# EAGLE design stx_v2 (EAGLE 7.7.0)
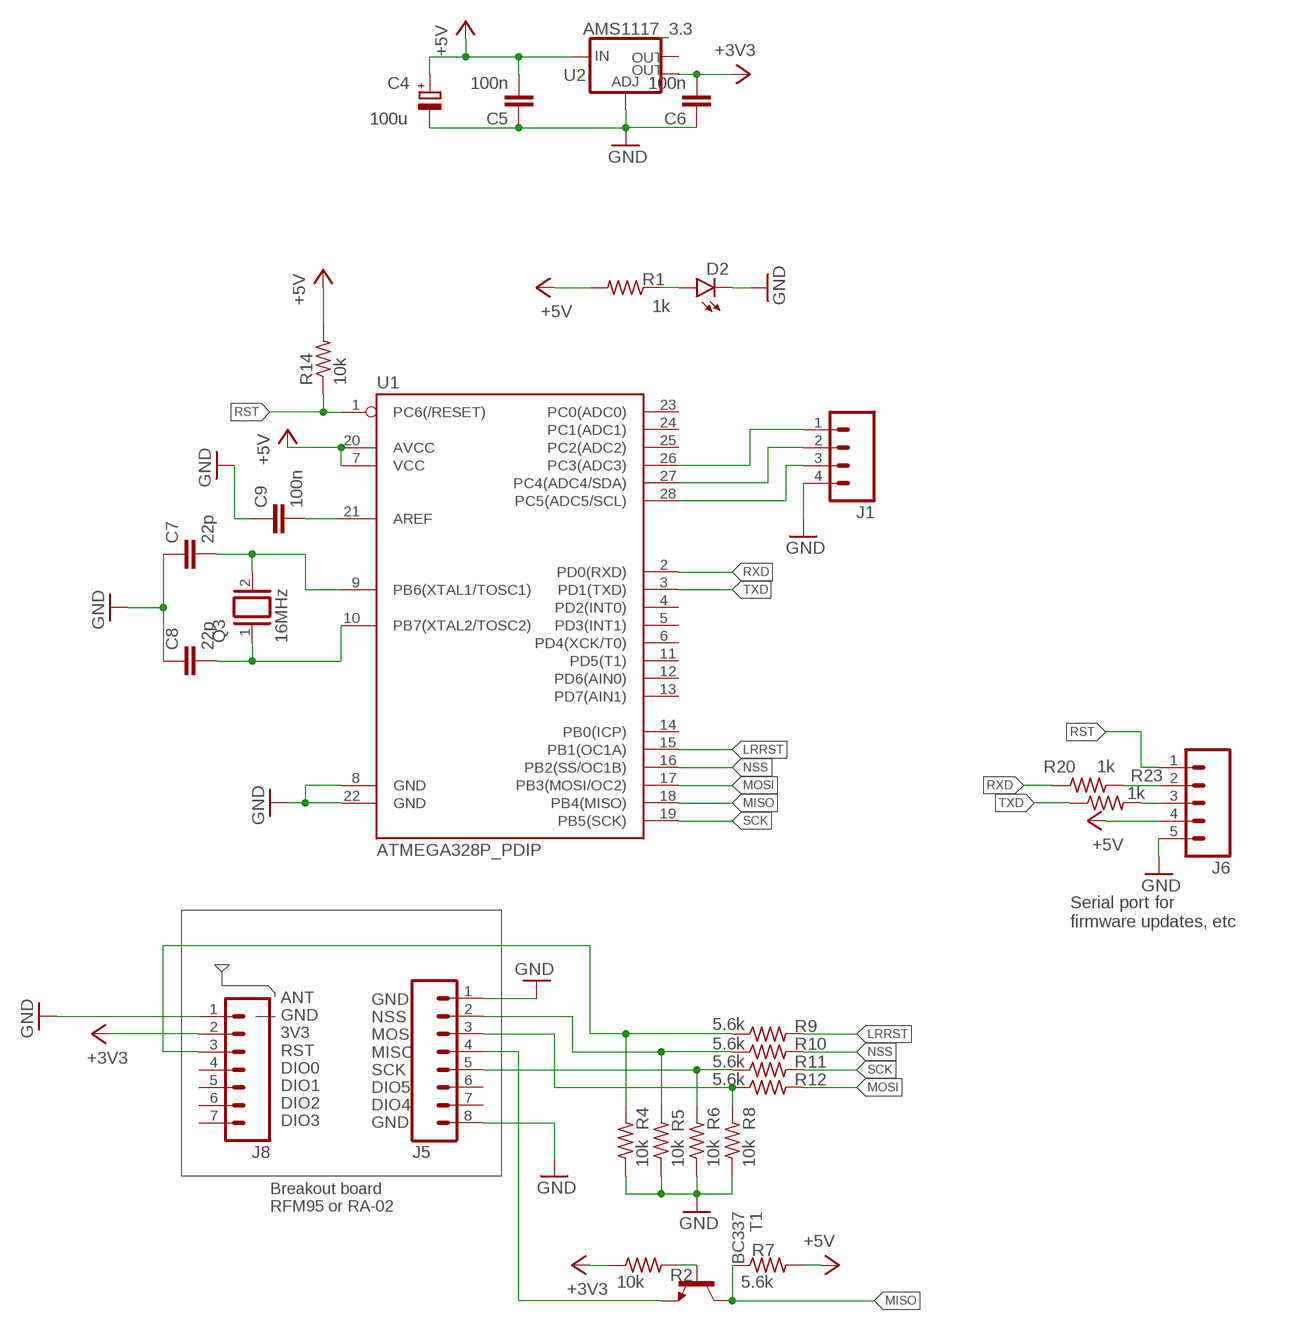
[diagram p0: schematic, sheet 1]

## Parts
C4  100u  CPOL-EUE2,5-6E  [E2,5-6E]
C5  100n  C-EU050-024X044  [C050-024X044]
C6  100n  C-EU050-024X044  [C050-024X044]
C7  22p  C-EU050-024X044  [C050-024X044]
C8  22p  C-EU050-024X044  [C050-024X044]
C9  100n  C-EU050-024X044  [C050-024X044]
D2  LED3MM  [LED3MM]
J1  M04PTH  [1X04]
J5  M08  [1X08_ROUND]
J6  M05PTH  [1X05]
J8  M07  [1X07]
Q3  16MHz  XTAL/S  [QS]
R1  1k  R-US_0204/2V  [0204V]
R2  10k  R-US_0204/7  [0204/7]
R4  10k  R-US_0204/2V  [0204V]
R5  10k  R-US_0204/2V  [0204V]
R6  10k  R-US_0204/2V  [0204V]
R7  5.6k  R-US_0204/2V  [0204V]
R8  10k  R-US_0204/2V  [0204V]
R9  5.6k  R-US_0204/2V  [0204V]
R10  5.6k  R-US_0204/2V  [0204V]
R11  5.6k  R-US_0204/2V  [0204V]
R12  5.6k  R-US_0204/2V  [0204V]
R14  10k  R-US_0204/7  [0204/7]
R20  1k  R-US_0204/7  [0204/7]
R23  1k  R-US_0204/7  [0204/7]
T1  BC337  [TO92]
U1  ATMEGA328P_PDIP  [DIL28-3]
U2  AMS1117_3.3  V_REG_LM1117SOT223  [SOT223]

## Nets
+3V3: C6.2 J8.2 R2.1 U2.4(OUT)
+5V: C4.+ C5.2 J6.4 R1.2 R7.2 R14.2 U1.7(VCC) U1.20(AVCC) U2.3(IN)
GND: C4.- C5.1 C6.1 C7.1 C8.1 C9.1 D2.K(C) J1.4 J5.1 J5.8 J6.5 J8.1 R4.1 R5.1 R6.1 R8.1 U1.8(GND) U1.22(GND) U2.1(ADJ)
LRRST: R9.2 U1.15(PB1(OC1A))
MISO: R7.1 T1.3(C) U1.18(PB4(MISO))
MOSI: R12.2 U1.17(PB3(MOSI/OC2))
N$1: D2.A R1.1
N$2: J1.3 U1.28(PC5(ADC5/SCL))
N$3: J5.4 T1.1(E)
N$4: J1.2 U1.27(PC4(ADC4/SDA))
N$5: J1.1 U1.26(PC3(ADC3))
N$6: J8.3 R4.2 R9.1
N$7: J5.2 R5.2 R10.1
N$8: J5.5 R6.2 R11.1
N$9: J5.3 R8.2 R12.1
N$10: C9.2 U1.21(AREF)
N$14: J6.3 R23.2
N$17: C7.2 Q3.2 U1.9(PB6(XTAL1/TOSC1))
N$19: C8.2 Q3.1 U1.10(PB7(XTAL2/TOSC2))
N$21: J6.2 R20.2
N$33: R2.2 T1.2(B)
NSS: R10.2 U1.16(PB2(SS/OC1B))
RST: J6.1 R14.1 U1.1(PC6(/RESET))
RXD: R20.1 U1.2(PD0(RXD))
SCK: R11.2 U1.19(PB5(SCK))
TXD: R23.1 U1.3(PD1(TXD))
Unconnected: J5.6 J5.7 J8.4 J8.5 J8.6 J8.7 U1.4(PD2(INT0)) U1.5(PD3(INT1)) U1.6(PD4(XCK/T0)) U1.11(PD5(T1)) U1.12(PD6(AIN0)) U1.13(PD7(AIN1)) U1.14(PB0(ICP)) U1.23(PC0(ADC0)) U1.24(PC1(ADC1)) U1.25(PC2(ADC2)) U2.2(OUT)

## Notes on the sheet
- Serial port for
  firmware updates, etc
- ANT
  GND
  3V3
  RST
  DIO0
  DIO1
  DIO2
  DIO3
- GND
  NSS
  MOSI
  MISO
  SCK
  DIO5
  DIO4
  GND
- Breakout board
  RFM95 or RA-02

## Library data of the parts
C4 = rcl:CPOL-EU: POLARIZED CAPACITOR, European symbol
C5-C9 = rcl:C-EU: CAPACITOR, European symbol
D2 = SparkFun-LED:LED: LEDs Standard schematic elements and footprints for 5mm, 3mm, 1206, and 0603 sized LEDs. 5mm - Spark Fun Electronics SKU : COM-00529 (and others); PROD_ID: DIO-08794
J1 = SparkFun-Connectors:M04: Header 4 Standard 4-pin 0.1" header. Use with straight break away headers (SKU : PRT-00116), right angle break away headers (PRT-00553), swiss pins (PRT-00743), machine pins (PRT-00117), and female headers (PRT-00115). Molex polarized connector foot print use with SKU : PRT-08231 with associated crimp pins and housings. 1MM SMD Version SKU: PRT-10208; PROD_ID: CONN-09696
J5 = SparkFun-Connectors:M08: Header 8 Standard 8-pin 0.1" header. Use with straight break away headers (SKU : PRT-00116), right angle break away headers (PRT-00553), swiss pins (PRT-00743), machine pins (PRT-00117), and female headers (PRT-00115).; PROD_ID: CONN-08437
J6 = SparkFun-Connectors:M05: Header 5 Standard 5-pin 0.1" header. Use with straight break away headers (SKU : PRT-00116), right angle break away headers (PRT-00553), swiss pins (PRT-00743), machine pins (PRT-00117), and female headers (PRT-00115). Molex polarized connector foot print use with SKU : PRT-08230 with associated crimp pins and housings.
J8 = SparkFun-Connectors:M07: Header 7 Standard 7-pin 0.1" header. Use with straight break away headers (SKU : PRT-00116), right angle break away headers (PRT-00553), swiss pins (PRT-00743), machine pins (PRT-00117), and female headers (PRT-00115). NOTES ON THE VARIANTS LOCK and LOCK_LONGPADS... This footprint was designed to help hold the alignment of a through-hole component (i.e. 7-pin header) while soldering it into place. You may notice that each hole has been shifted either up or down by 0.005 of an inch from it's more standard position (which is usually a perfectly straight line). This slight alteration caused the pins (the squares in the middle) to touch the edges of the holes. Because they are alternating, it causes a "brace" to hold the header in place. 0.005 has proven to be the perfect amount of "off-center" position when using our standard breakaway headers. Although looks a little odd when you look at the bare footprint, once you have a header in there, the alteration is very hard to notice. Also, if you push a header all the way into place, it is covered up entirely on the bottom side. This idea of altering the position of holes to aid alignment will be further integrated into the Sparkfun Library for other footprints. It can help hold any component with 3 or more connection pins.
Q3 = special:XTAL/S: CRYSTAL
R1 R2 R4-R12 R14 R20 R23 = rcl:R-US_: RESISTOR, American symbol
T1 = transistor:BC337: NPN TRANSISTOR
U1 = SparkFun-DigitalIC:ATMEGA328P_PDIP: uC used in the Arduino 32kb flash, 1k EEPROM, 2k SRAM This is the through-hole version of this chip.
U2 = SparkFun-PowerIC:V_REG_LM1117: Voltage Regulator LM1117 Standard adjustable voltage regulator but in SMD form. Spark Fun Electronics SKU : COM-00595; PROD_ID: VREG-08170

## Net classes
1 rf: clearance 0.5 mm

## Board
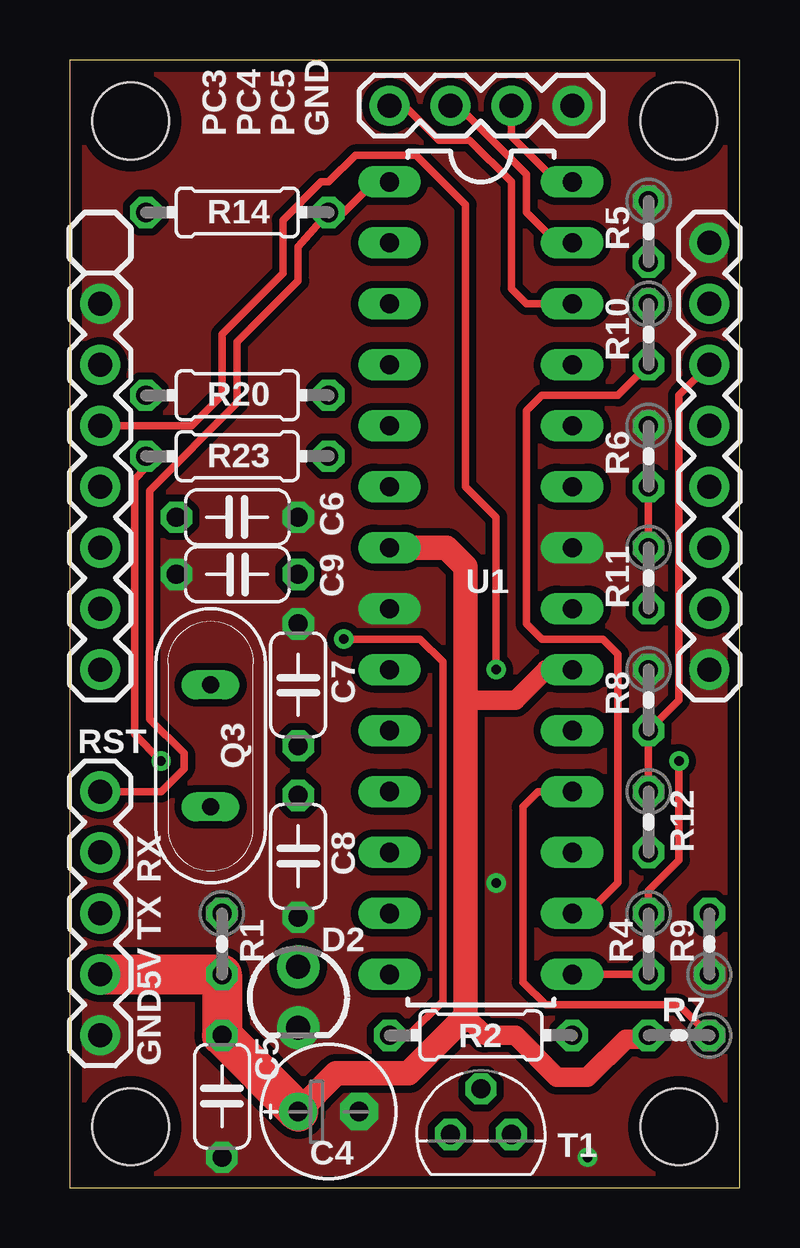
[diagram p1: board, top side]
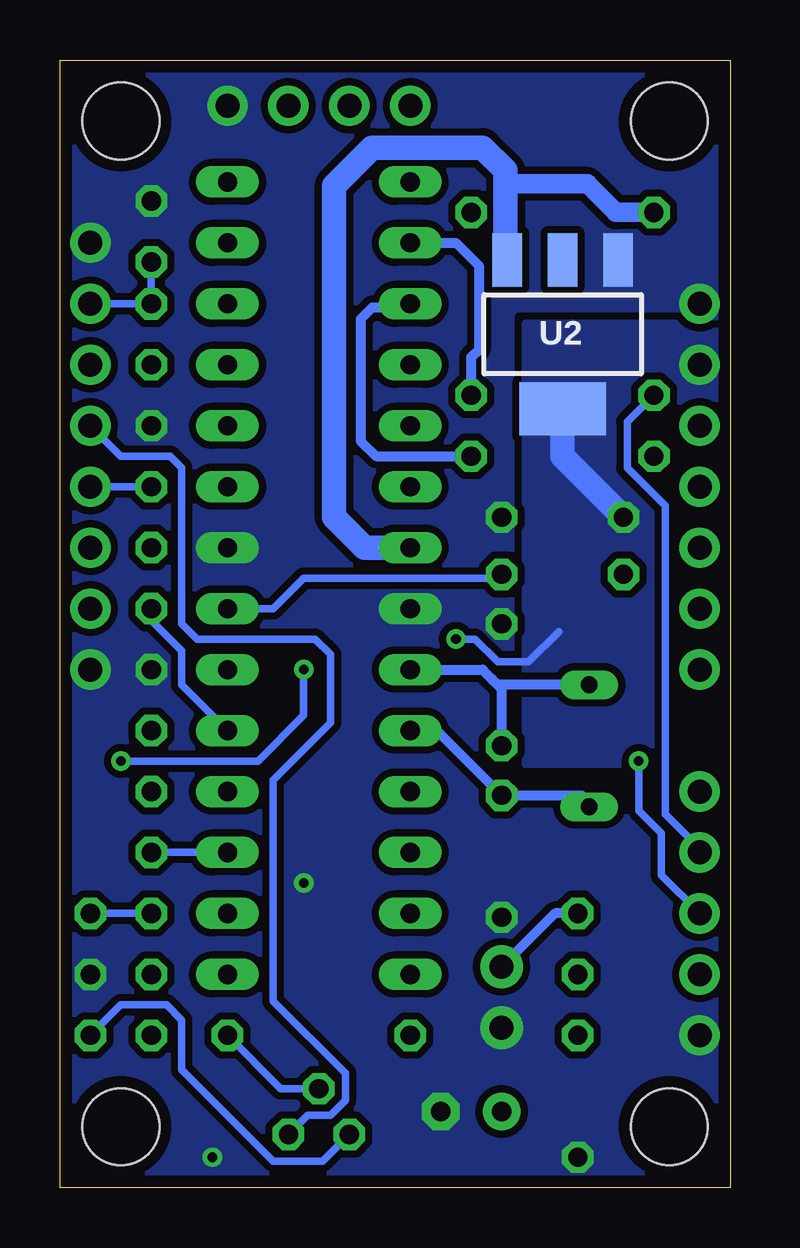
[diagram p2: board, bottom side, seen from below]

Size 27.94 x 46.99 mm. Coordinates in mm from the lower left corner, seen from the top.
Outline: 27.94,0 27.94,46.99 0,46.99 0,0 27.94,0
Copper layers (1*16): Top 0.035mm / dielectric 1.5mm / Bottom 0.035mm
Design rules "default *": minimum track width 10mil, minimum drill 0.4mm, track to track 0.3mm, track to pad 0.3mm, pad to pad 0.3mm, via to via 0.3mm, smd to smd 8mil, copper to edge 0.5mm, drill to drill 8mil, minimum pad ring 10mil, minimum via ring 8mil, stop-mask expansion 4mil, vias tented up to drill 0.8mm, thermal gap 10mil
Holes 3.2 mm at 2.54,44.45 25.4,44.45 2.54,2.54 25.4,2.54

### Footprints (pad centres in the part's own frame; a part is rotated, then mirrored left to right if it is on the bottom)
E2,5-6E = drill 0.8 pad 1.575: + -1.27,0 | drill 0.8 pad 1.575 octagon: - 1.27,0
C050-024X044 = drill 0.8 octagon: 1 -2.54,0; 2 2.54,0
LED3MM = drill 1 pad 1.778: A -1.27,0; K 1.27,0
1X04 = drill 1 pad 1.676: 1 0,0; 2 2.54,0; 3 5.08,0; 4 7.62,0
1X08_ROUND = drill 1 pad 1.676: 1 0,0; 2 2.54,0; 3 5.08,0; 4 7.62,0; 5 10.16,0; 6 12.7,0; 7 15.24,0; 8 17.78,0
1X05 = drill 1 pad 1.676: 1 0,0; 2 2.54,0; 3 5.08,0; 4 7.62,0; 5 10.16,0
1X07 = drill 1 pad 1.676: 1 0,0; 2 2.54,0; 3 5.08,0; 4 7.62,0; 5 10.16,0; 6 12.7,0; 7 15.24,0
QS = drill 0.7 pad 1.016 long: 1 -2.54,0; 2 2.54,0
0204V = drill 0.8 octagon: 1 -1.27,0; 2 1.27,0
0204/7 = drill 0.8 octagon: 1 -3.81,0; 2 3.81,0
TO92 = drill 0.8 octagon: 1 1.27,0; 2 0,1.905; 3 -1.27,0
DIL28-3 = drill 0.8 long: 1 -16.51,-3.81; 2 -13.97,-3.81; 3 -11.43,-3.81; 4 -8.89,-3.81; 5 -6.35,-3.81; 6 -3.81,-3.81; 7 -1.27,-3.81; 8 1.27,-3.81; 9 3.81,-3.81; 10 6.35,-3.81; 11 8.89,-3.81; 12 11.43,-3.81; 13 13.97,-3.81; 14 16.51,-3.81; 15 16.51,3.81; 16 13.97,3.81; 17 11.43,3.81; 18 8.89,3.81; 19 6.35,3.81; 20 3.81,3.81; 21 1.27,3.81; 22 -1.27,3.81; 23 -3.81,3.81; 24 -6.35,3.81; 25 -8.89,3.81; 26 -11.43,3.81; 27 -13.97,3.81; 28 -16.51,3.81
SOT223 = smd 1.219 x 2.235: 1 -2.311,-3.099; 2 0,-3.099; 3 2.311,-3.099 | smd 3.6 x 2.2: 4 0,3.099

### Placement (x,y rotation side)
C4  10.79,3.17 0 top
C5  6.35,3.81 90 top
C6  6.99,27.94 180 top
C7  9.53,20.95 270 top
C8  9.53,13.81 90 top
C9  6.99,25.56 0 top
D2  9.53,7.94 270 top
J1  13.34,45.09 0 top
J5  26.67,39.37 270 top
J6  1.27,16.51 270 top
J8  1.27,36.83 270 top
Q3  5.87,18.41 90 top
R1  6.35,10.16 270 top
R2  17.14,6.35 0 top
R4  26.67,10.16 90 top
R5  24.13,39.85 270 top
R6  24.13,30.48 270 top
R7  25.4,6.35 180 top
R8  24.13,20.32 270 top
R9  24.13,10.16 270 top
R10  24.13,35.56 270 top
R11  24.13,25.4 270 top
R12  24.13,15.24 270 top
R14  6.99,40.64 180 top
R20  6.99,33.02 180 top
R23  6.99,30.48 180 top
T1  17.14,2.22 0 top
U1  17.14,25.4 270 top
U2  6.99,35.56 180 bottom

### Tracks (layer width: path | path; a pad name or v marks a point on that pad's centre or on a via)
+3V3  (via drill 0.4)
  Top 0.305: v11.43,22.86 14.61,22.86 15.56,21.91 15.56,7.78 14.13,6.35 R2.1
  Bottom 0.305: v11.43,22.86 10.64,22.86 9.68,21.91 8.41,21.91 7.14,23.18
  Bottom 1.016: C6.2 6.99,30.48 U2.4
  pour Bottom (isolate 0.305, no thermals): 0,36.04 8.57,36.04 8.57,17.62 0,17.62
+5V
  Top 0.813: U1.20 19.84,21.59 18.57,20.32 16.51,20.32 | R7.2 23.97,6.19 23.18,6.19 21.59,4.6 20.32,4.6 18.57,6.35 17.3,6.35 16.51,7.14
  Top 1.016: C4.+ 11.11,4.76 14.13,4.76 16.51,7.14 16.51,20.32 16.51,25.88 15.72,26.67 U1.7
  Top 1.676: J6.4 R1.2 C5.2 C4.+
  Bottom 0.813: U2.3 9.21,38.75 | R14.2 4.76,40.64 5.95,41.83 9.29,41.83 9.37,41.91
  Bottom 1.016: U1.7 15.24,26.67 16.51,27.94 16.51,41.75 14.92,43.34 10.32,43.34 9.37,42.39 9.37,41.91 9.37,38.73 U2.3
GND  (via drill 0.4)
  other vias: 21.59,1.27 17.78,12.7
  pour Bottom (rank 3, no thermals): 0,46.99 27.94,46.99 27.94,0 0,0
  pour Top (isolate 0.305, rank 3, no thermals): 0,46.99 27.94,46.99 27.94,0 0,0
LRRST
  Top 0.305: R9.2 U1.15
MISO
  Top 0.305: U1.18 19.53,16.51 18.89,15.88 18.89,8.57 19.84,7.62 25.4,7.62 R7.1
  Bottom 0.305: T1.3 16.99,1.11 19.05,1.11 22.86,4.92 22.86,6.99 23.5,7.62 25.4,7.62 R7.1
MOSI
  Bottom 0.305: U1.17 R12.2
N$1
  Bottom 0.406: R1.1 7.3,11.43 D2.A
N$2
  Top 0.305: U1.28 20.32,41.91 18.41,43.81 J1.3
N$3
  Bottom 0.305: J5.4 25.4,30.48 23.34,30.48 22.86,30 22.86,23.5 22.23,22.86 17.3,22.86 16.67,22.23 16.67,19.37 19.05,16.99 19.05,7.78 16.03,4.76 16.03,3.65 16.67,3.02 17.62,3.02 T1.1
N$4
  Top 0.305: U1.27 20.32,39.37 19.05,40.64 19.05,42.23 16.19,45.09 J1.2
N$5
  Top 0.305: J1.1 13.49,44.93 14.13,44.93 15.4,43.66 16.67,43.66 18.41,41.91 18.41,37.47 19.05,36.83 U1.26
N$6  (via drill 0.4)
  Top 0.305: J8.3 5.08,31.75 6.35,33.02 6.35,35.56 8.89,38.1 8.89,40.32 10.48,41.91 10.79,41.91 11.91,43.02 14.45,43.02 16.51,40.96 16.51,29.21 17.78,27.94 v17.78,21.59 | v25.4,17.78 25.4,13.65 24.13,12.38 R9.1
  Bottom 0.305: v25.4,17.78 19.68,17.78 17.78,19.68 v17.78,21.59 | R9.1 R4.2
N$7
  Bottom 0.305: J5.2 R10.1 R5.2
N$8
  Top 0.305: R6.2 R11.1
  Bottom 0.305: R6.2 J5.5
N$9
  Top 0.305: J5.3 25.4,33.02 25.4,20.32 R8.2 R12.1
N$10
  Bottom 0.305: U1.21 19.05,24.13 17.78,25.4 9.68,25.4 C9.2
N$14  (via drill 0.4)
  Top 0.305: R23.2 3.17,30 2.7,29.53 2.7,18.89 v3.81,17.78
  Bottom 0.305: J6.3 2.86,13.02 2.86,14.76 3.81,15.72 v3.81,17.78
N$17
  Bottom 0.406: U1.9 10.32,21.59 9.92,21.19 9.68,20.95 | 9.68,20.95 9.53,20.8 C7.2 | Q3.2 9.68,20.95
N$19
  Bottom 0.406: U1.10 12.22,19.05 C8.2 6.19,16.35 Q3.1
N$21
  Bottom 0.305: R20.2 4.29,31.91 4.29,30 2.7,28.42 2.7,15.56 1.27,14.13 J6.2
N$33
  Bottom 0.305: R2.2 18.73,4.13 T1.2
NSS
  Top 0.305: R10.2 22.86,33.02 19.68,33.02 19.05,32.38 19.05,23.5 19.68,22.86 22.23,22.86 22.86,22.23 22.86,12.7 21.59,11.43 U1.16
RST
  Top 0.305: U1.1 12.7,41.91 11.43,40.64 R14.1 9.53,39.21 9.53,37.78 6.99,35.24 6.99,32.7 3.33,29.05 3.33,19.53 4.76,18.1 4.76,17.46 3.81,16.51 J6.1
RXD
  Bottom 0.406: U1.2 11.43,39.37 10.48,38.42 10.48,34.92 10.79,34.61 R20.1
SCK
  Bottom 0.305: R11.2 24.13,23.65 22.86,22.38 22.86,20.95 U1.19
TXD
  Bottom 0.406: U1.3 13.49,36.67 14.92,36.67 15.4,36.2 15.4,31.11 14.76,30.48 R23.1

### Text on the board
tPlace: PC3 / PC4 / PC5 / GND
tNames: RST | RX | TX | 5V | GND